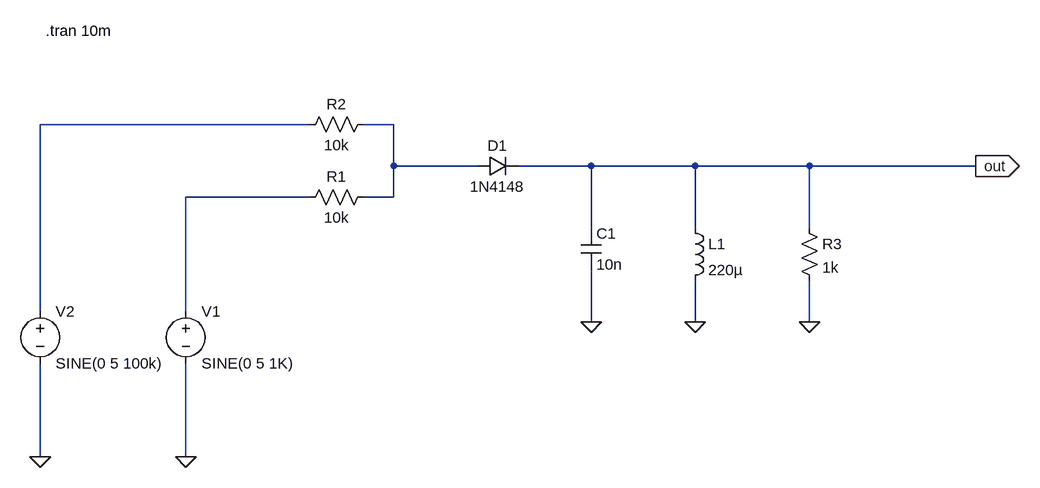
[diagram p0: schematic diode-am-modulator.asc]
diode-am-modulator.asc, the LTspice schematic file:
Version 4
SHEET 1 1424 680
WIRE 304 -112 -112 -112
WIRE 432 -112 384 -112
WIRE 432 -48 432 -112
WIRE 560 -48 432 -48
WIRE 736 -48 624 -48
WIRE 896 -48 736 -48
WIRE 1072 -48 896 -48
WIRE 1328 -48 1072 -48
WIRE 304 0 112 0
WIRE 432 0 432 -48
WIRE 432 0 384 0
WIRE 736 48 736 -48
WIRE 896 48 896 -48
WIRE 1072 48 1072 -48
WIRE -112 176 -112 -112
WIRE 112 176 112 0
WIRE 736 192 736 112
WIRE 896 192 896 128
WIRE 1072 192 1072 128
WIRE -112 400 -112 256
WIRE 112 400 112 256
FLAG -112 400 0
FLAG 112 400 0
FLAG 1328 -48 out
IOPIN 1328 -48 Out
FLAG 736 192 0
FLAG 896 192 0
FLAG 1072 192 0
SYMBOL voltage 112 160 R0
WINDOW 123 0 0 Left 0
WINDOW 39 0 0 Left 0
SYMATTR InstName V1
SYMATTR Value SINE(0 5 1K)
SYMBOL voltage -112 160 R0
WINDOW 123 0 0 Left 0
WINDOW 39 0 0 Left 0
SYMATTR InstName V2
SYMATTR Value SINE(0 5 100k)
SYMBOL res 400 -16 R90
WINDOW 0 0 56 VBottom 2
WINDOW 3 32 56 VTop 2
SYMATTR InstName R1
SYMATTR Value 10k
SYMBOL res 400 -128 R90
WINDOW 0 0 56 VBottom 2
WINDOW 3 32 56 VTop 2
SYMATTR InstName R2
SYMATTR Value 10k
SYMBOL diode 560 -32 R270
WINDOW 0 32 32 VTop 2
WINDOW 3 0 32 VBottom 2
SYMATTR InstName D1
SYMATTR Value 1N4148
SYMBOL cap 720 48 R0
SYMATTR InstName C1
SYMATTR Value 10n
SYMBOL ind 880 32 R0
SYMATTR InstName L1
SYMATTR Value 220µ
SYMBOL res 1056 32 R0
SYMATTR InstName R3
SYMATTR Value 1k
TEXT -104 -256 Left 2 !.tran 10m

The netlist it stands for:
* diode-am-modulator.asc
V1 N003 0 SINE(0 5 1K)
V2 N001 0 SINE(0 5 100k)
R1 N002 N003 10k
R2 N002 N001 10k
D1 N002 out 1N4148
C1 out 0 10n
L1 out 0 220µ
R3 out 0 1k
.model D D
.lib standard.dio
.tran 10m
.backanno
.end